# Altium schematic sheet LED_Schematic.SchDoc
size A
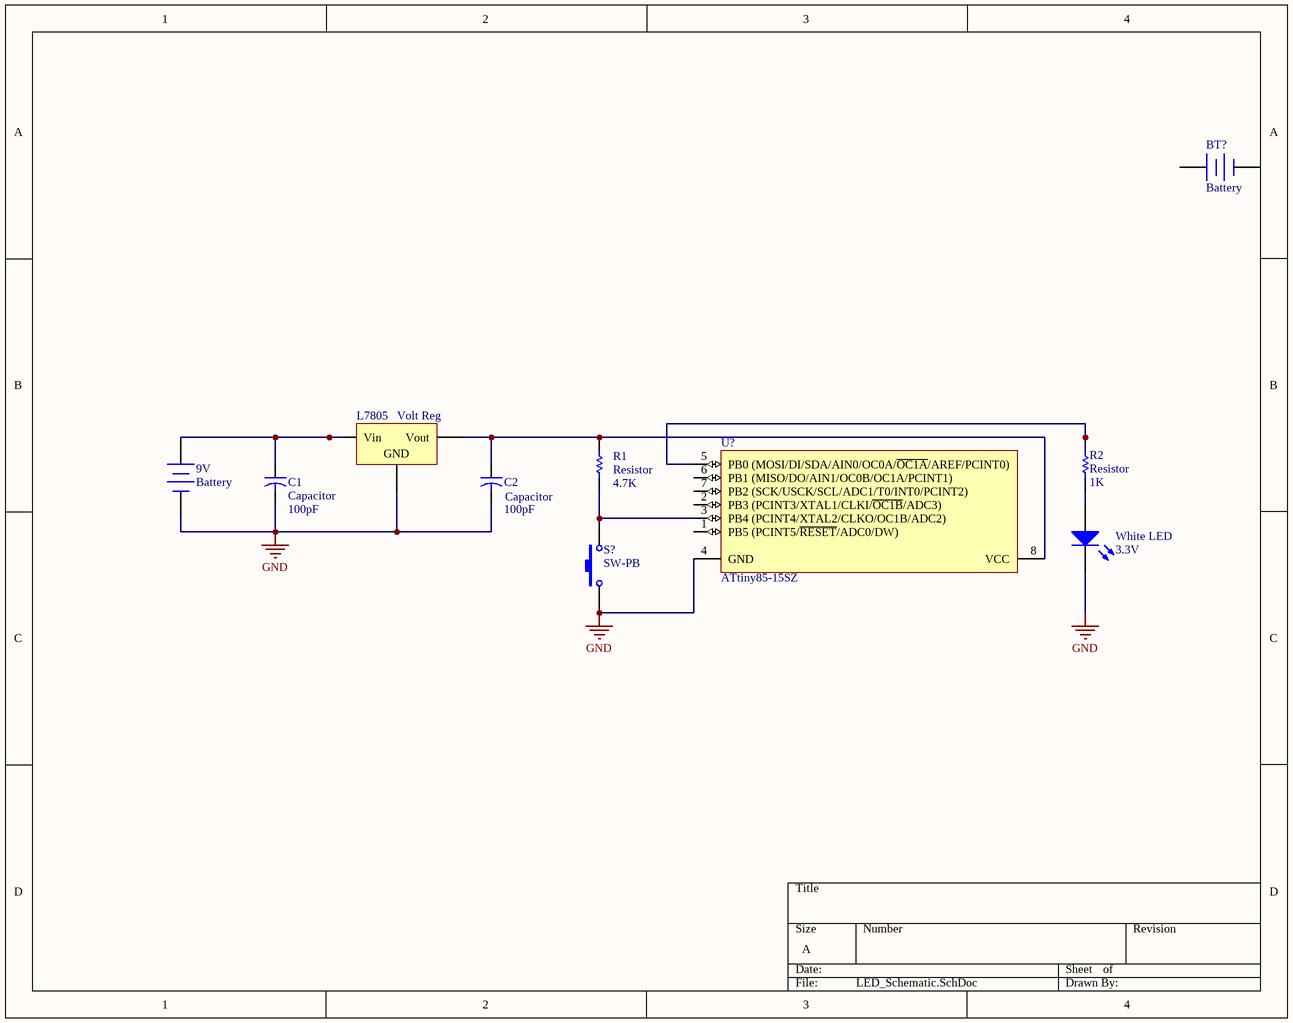
[diagram p0: LED_Schematic.SchDoc]

## Parts
9V  Battery  [BAT-2]
BT?  Battery  [BAT-2]
C1  Capacitor  value 100pF  [CAPR5-4X5]
C2  Capacitor  value 100pF  [CAPR5-4X5]
L7805  Volt Reg  [D2PAK_N]
R1  Resistor  value 4.7K  [AXIAL-0.3]
R2  Resistor  value 1K  [AXIAL-0.3]
S?  SW-PB  [SPST-2]
U?  ATtiny85-15SZ  [T5_N]
White_LED  3.3V  [LED-1]

## Nets
GND: 9V.2(-) C1.2 C2.2 L7805.2(GND) S?.1 U?.4(GND) White_LED.2(K)
Net9V_1: 9V.1(+) C1.1 L7805.1(Vin)
NetC2_1: C2.1 L7805.3(Vout) R1.1 U?.8(VCC)
NetR1_2: R1.2 S?.2 U?.3(PB4_(PCINT4/XTAL2/CLKO/OC1B/ADC2))
NetR2_1: R2.1 White_LED.1(A)
NetR2_2: R2.2 U?.5(PB0_(MOSI/DI/SDA/AIN0/OC0A/~{OC1A}/AREF/PCINT0))

Not connected (* = marked no-connect by the designer): BT? 1(+) 2(-); U? 1(PB5_(PCINT5/~{RESET}/ADC0/DW)) 2(PB3_(PCINT3/XTAL1/CLKI/~{OC1B}/ADC3)) 6(PB1_(MISO/DO/AIN1/OC0B/OC1A/PCINT1)) 7(PB2_(SCK/USCK/SCL/ADC1/T0/INT0/PCINT2))

## Library data of the parts
9V BT? = Battery: Multicell Battery; Published: 24-Mar-1999; LatestRevisionDate: 17-Jul-2002; LatestRevisionNote: Re-released for DXP Platform.; PackageReference: BAT-2; Publisher: Altium Limited; PackageDescription: Battery; 2 Leads
C1 C2 = Cap2: Published: 23-Sep-2002; PackageReference: CAPR5-4X5; Publisher: Altium Limited; PackageDescription: Capacitor; 2 Leads
L7805 = Volt Reg: Voltage Regulator; Published: 24-Mar-1999; LatestRevisionDate: 29-May-2009; LatestRevisionNote: IPC-7351 Footprint Added.; PackageReference: D2PAK; Publisher: Altium Limited; PackageDescription: 3-Pin Transistor Outline Package 2.54 mm Pitch, 15.1 mm Lead Span
R1 R2 = Res1: Published: 8-Jun-2000; LatestRevisionDate: 17-Jul-2002; LatestRevisionNote: Re-released for DXP Platform.; PackageReference: AXIAL-0.3; Publisher: Altium Limited; PackageDescription: Axial Device, Thru-Hole; 2 Leads; 0.3 in Pin Spacing
S? = SW-PB: Switch; Published: 24-Mar-1999; LatestRevisionDate: 17-Jul-2002; LatestRevisionNote: Re-released for DXP Platform.; PackageReference: SPST-2; Publisher: Altium Limited; PackageDescription: Switch; 2 Leads
U? = ATtiny85-15SZ: 8-bit Automotive AVR Microcontroller, 8KB Flash, 512 Bytes EEPROM, 512 Bytes SRAM, Automotive Grade (-40°C to +125°C), 8-Pin SOIC; DatasheetVersion: revH, Jul-2009; PackageVersion: 2009; PackageReference: T5; PackageDescription: 8-Lead, 0.208" Body, Plastic Small Outline Package; ComponentLink1Description: Manufacturer URL; ComponentLink1URL: http://www.atmel.com/; ComponentLink2Description: ATtiny25/45/85 Datasheet; ComponentLink2URL: http://www.atmel.com/dyn/resources/prod_documents/doc7598.pdf
White_LED = LED1: Typical RED GaAs LED; Published: 8-Jun-2000; LatestRevisionDate: 08-Jul-2005; LatestRevisionNote: Mech Layer 1 removed.; PackageReference: LED-1; Publisher: Altium Limited; PackageDescription: LED; 2 Leads